# EAGLE design Drury-DABSC (EAGLE 7.7.0)
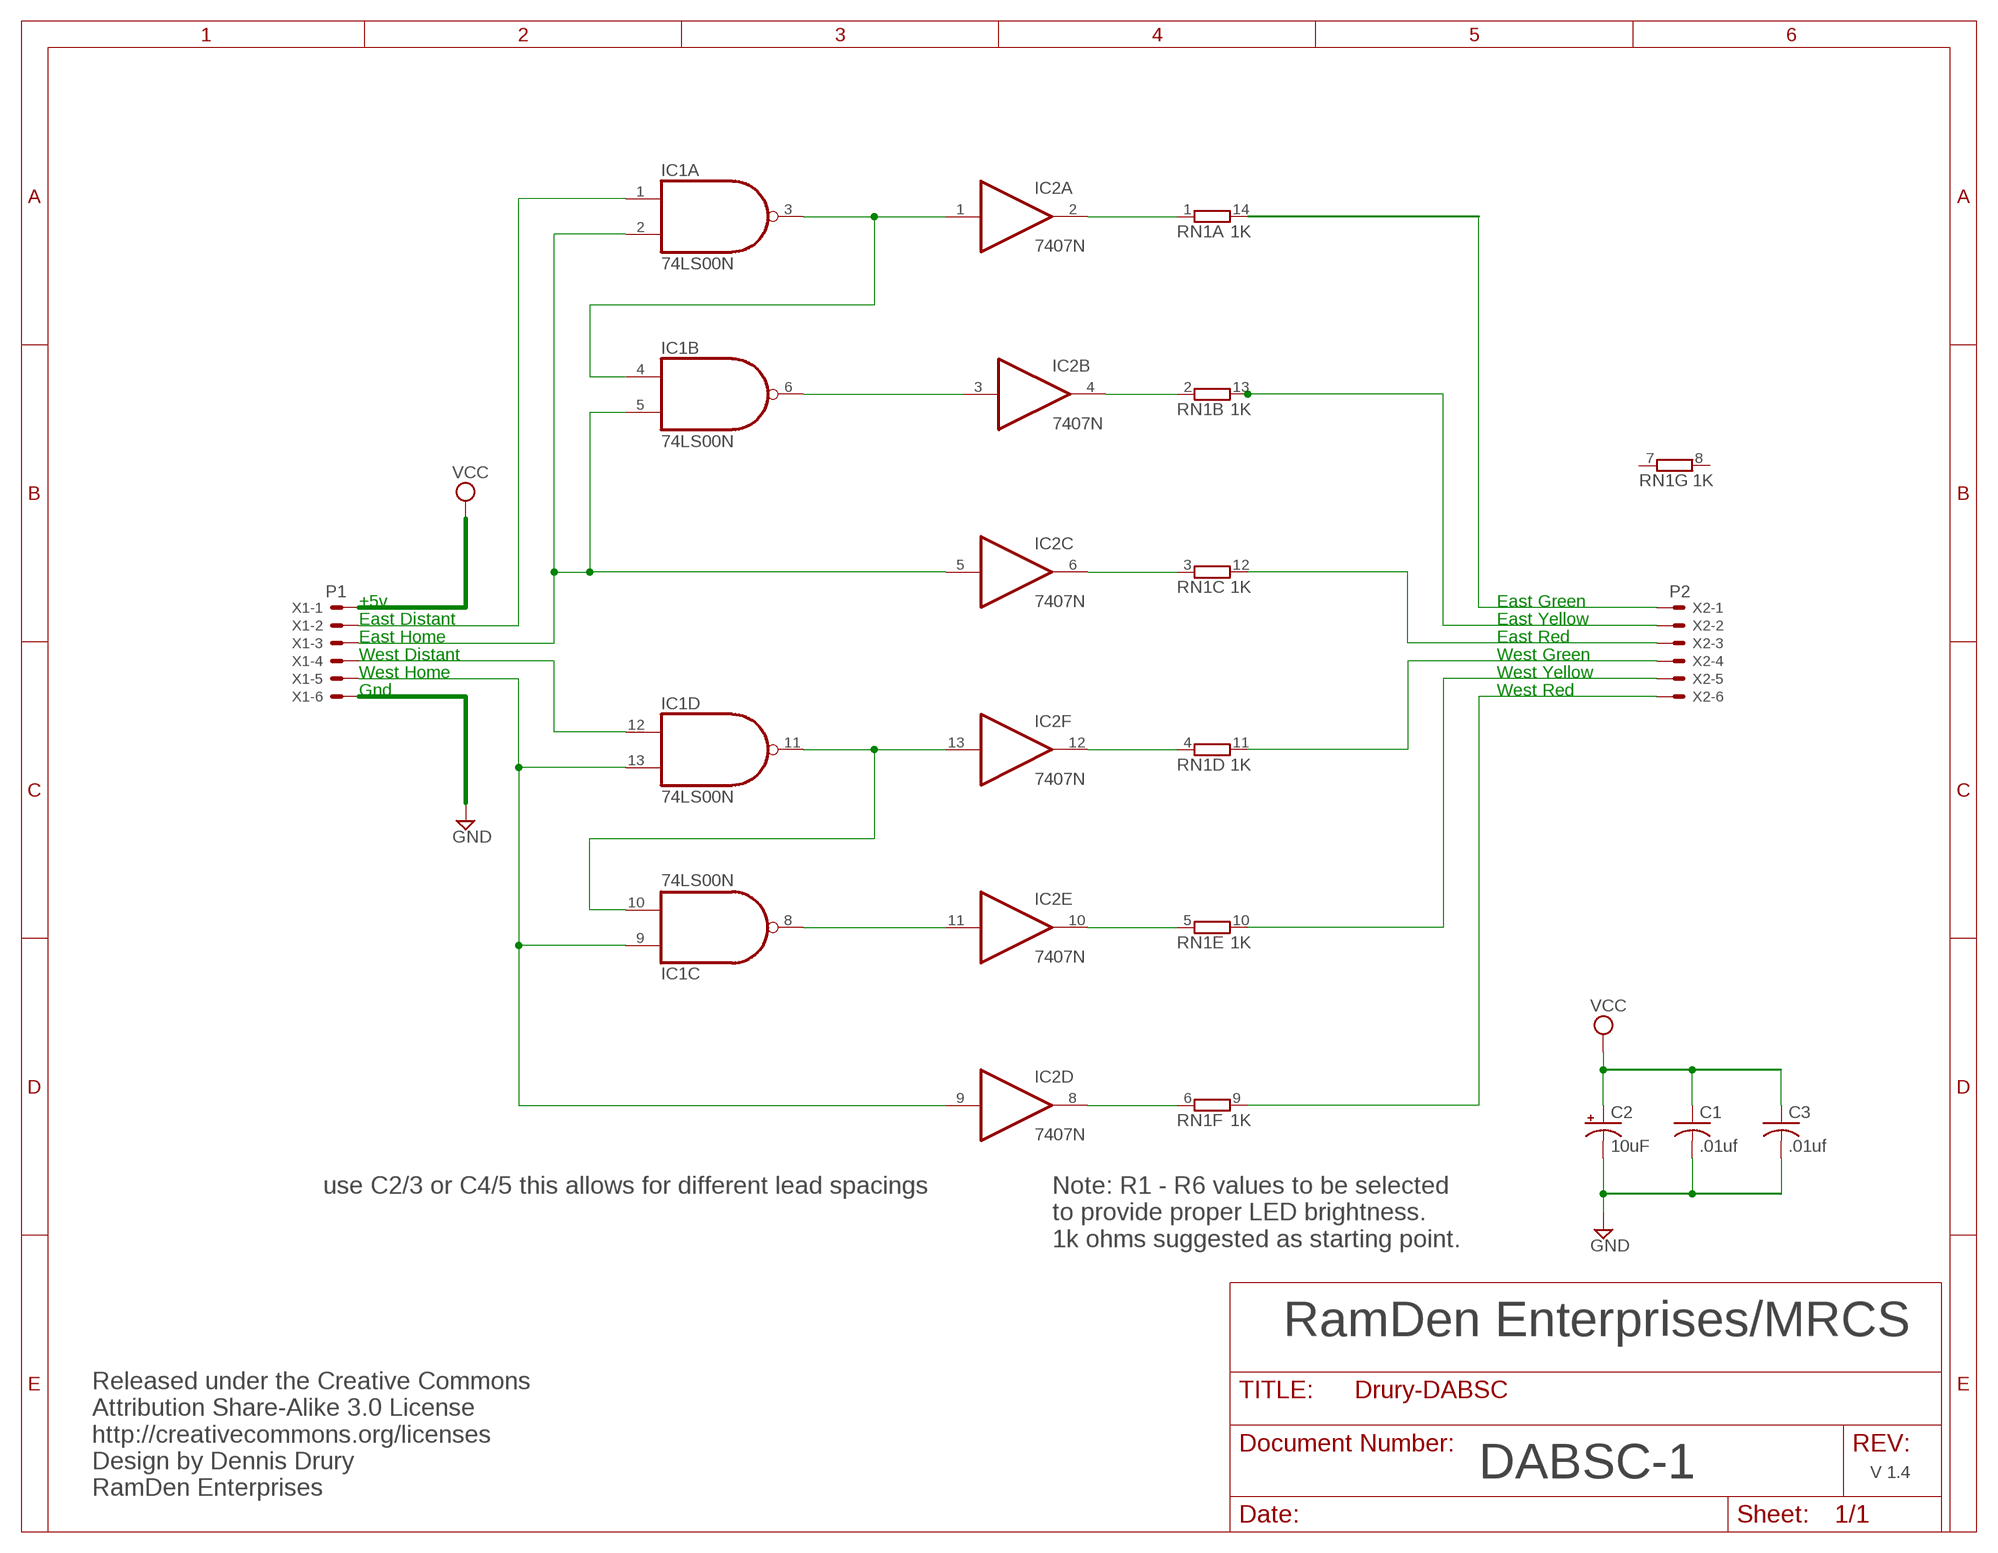
[diagram p0: schematic, sheet 1]

## Parts
C1  .01uf  C-US050-025X075  [C050-025X075]
C2  10uF  CAP-POLPTH-2MM  [E2-5]
C3  .01uf  C-US050-025X075  [C050-025X075]
IC1  74LS00N  [DIL14]
IC2  7407N  [DIL14]
RN1  1K  7R-N  [DIL14]
X1  P1  22-23-2061  [22-23-2061]
X2  P2  22-23-2061  [22-23-2061]

## Nets
GND [Power]: C1.2 C2.- C3.2 X1.6
N$1: IC1.3(A:O) IC1.4(B:I0) IC2.1(A:I)
N$2: IC1.6(B:O) IC2.3(B:I)
N$3: IC2.2(A:O) RN1.1
N$4 [Power]: IC1.8(C:O) IC2.11(E:I)
N$5: IC2.4(B:O) RN1.2
N$6: IC1.10(C:I1) IC1.11(D:O) IC2.13(F:I)
N$7: IC2.6(C:O) RN1.3
N$8: RN1.14 X2.1
N$9: RN1.13 X2.2
N$10: IC1.1(A:I0) X1.2
N$11: IC1.2(A:I1) IC1.5(B:I1) IC2.5(C:I) X1.3
N$12: RN1.12 X2.3
N$13: IC2.12(F:O) RN1.4
N$14: IC2.10(E:O) RN1.5
N$15: IC2.8(D:O) RN1.6
N$16: RN1.9 X2.6
N$17: RN1.10 X2.5
N$18: IC1.12(D:I0) X1.4
N$19: RN1.11 X2.4
N$21: IC1.9(C:I0) IC1.13(D:I1) IC2.9(D:I) X1.5
VCC [Power]: C1.1 C2.+ C3.1 X1.1
Unconnected: RN1.7 RN1.8

## Notes on the sheet
- +5v | East Green
- East Distant | East Yellow
- East Home | East Red
- West Distant | West Green
- West Home | West Yellow
- Gnd | West Red
- use C2/3 or C4/5 this allows for different lead spacings
- Note: R1 - R6 values to be selected
  to provide proper LED brightness.
  1k ohms suggested as starting point.
- RamDen Enterprises/MRCS
- DABSC-1 | V 1.4
- Released under the Creative Commons
  Attribution Share-Alike 3.0 License
  http://creativecommons.org/licenses
  Design by Dennis Drury
  RamDen Enterprises

## Power pins joined to a net without a drawn wire
GND: IC1.7(P:GND) IC2.7(P:GND)
VCC: IC1.14(P:VCC) IC2.14(P:VCC)

## Library data of the parts
C1 C3 = resistor:C-US: CAPACITOR, American symbol
C2 = SPCoast:CAP-POL*
IC1 = 74xx-us:74*00: Quad 2-input NAND gate
IC2 = 74xx-us:74*07: Hex BUFFER, open collector high-voltage output
RN1 = resistor-dil:7R-N: DIL RESISTOR; OC_FARNELL: unknown; OC_NEWARK: unknown
X1 X2 = con-molex:22-23-2061: .100" (2.54mm) Center Header - 6 Pin; MF: MOLEX; MPN: 22-23-2061; OC_FARNELL: 1462922; OC_NEWARK: 27C1933

## Net classes
0 Signal: width 0.051 mm, clearance 0.025 mm
1 Power: width 0.102 mm, clearance 0.025 mm to class 0

## Board
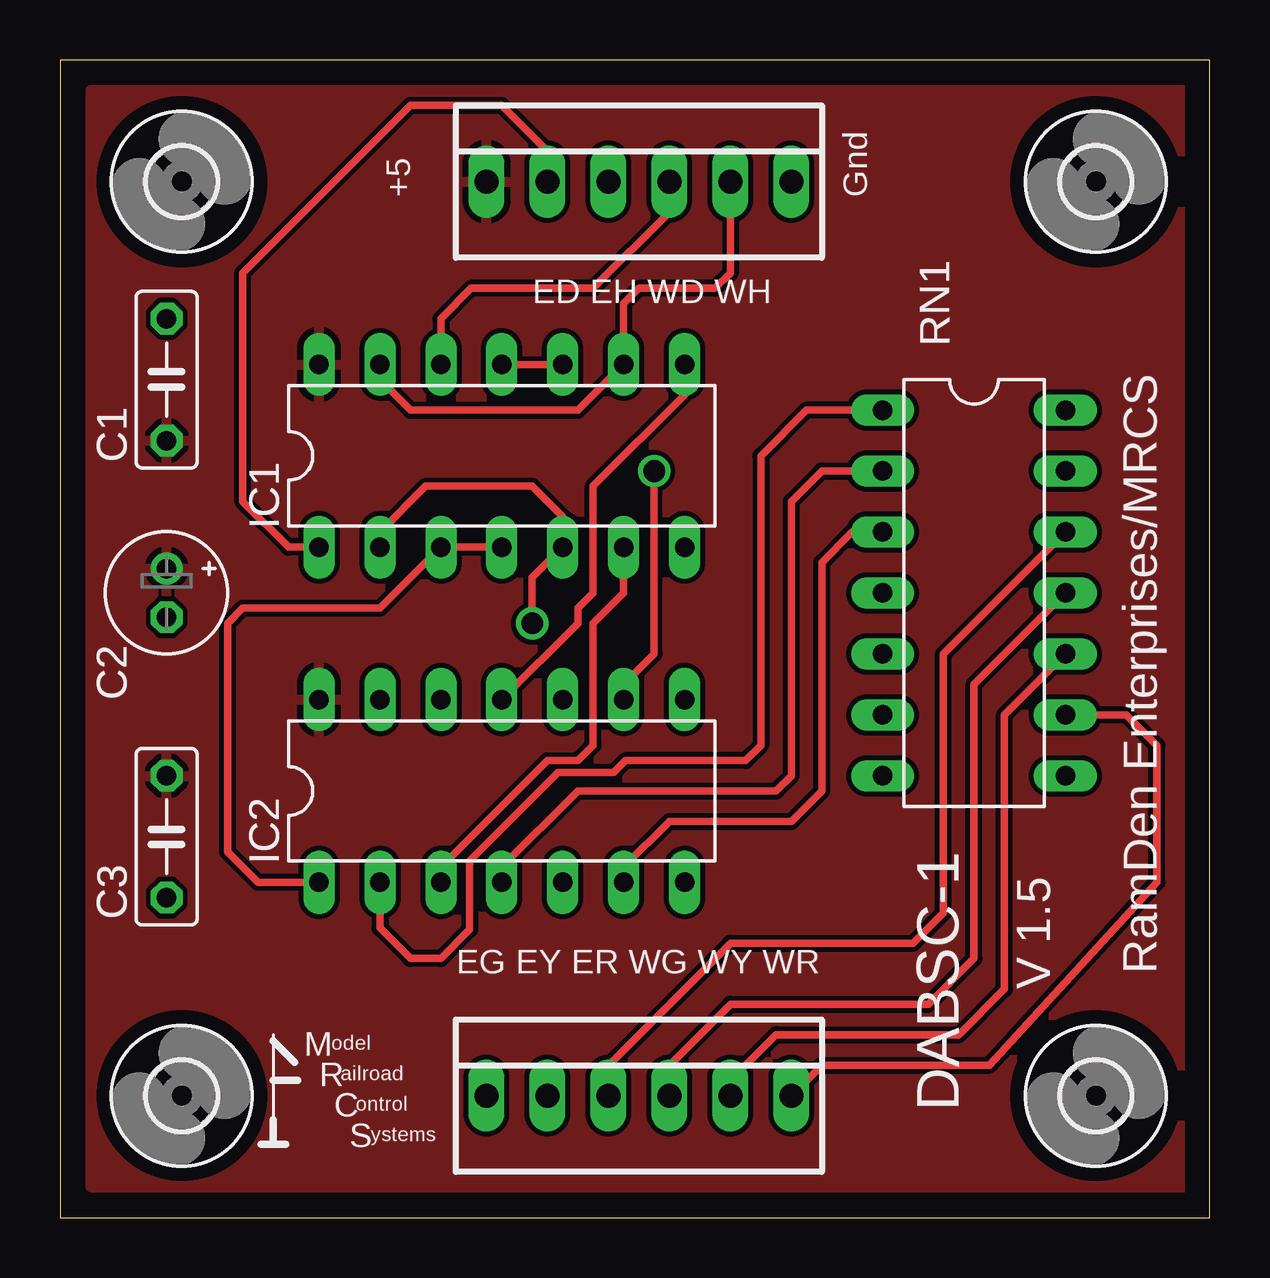
[diagram p1: board, top side]
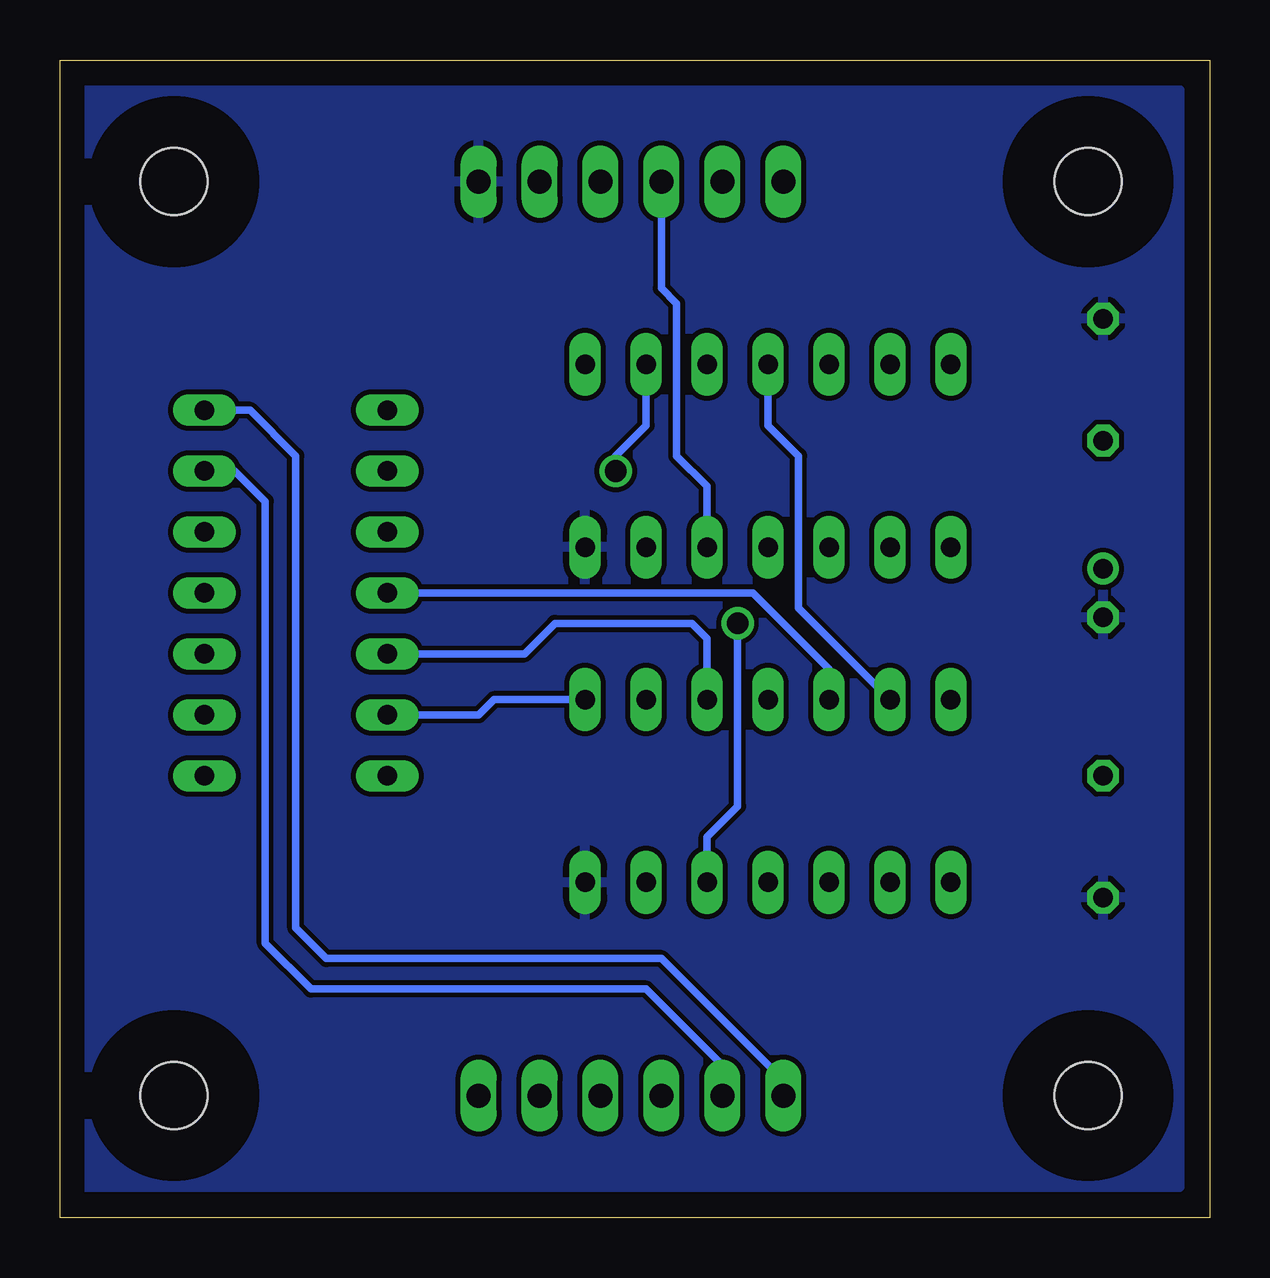
[diagram p2: board, bottom side, seen from below]

Size 47.93 x 48.25 mm. Coordinates in mm from the lower left corner, seen from the top.
Outline: 0,0 47.93,0 47.93,48.25 0,48.25 0,0
Copper layers (1*16): Top 0.035mm / dielectric 1.5mm / Bottom 0.035mm
Design rules "default": minimum track width 10mil, minimum drill 24mil, track to track 8mil, track to pad 8mil, pad to pad 8mil, via to via 8mil, smd to smd 8mil, copper to edge 40mil, drill to drill 8mil, minimum pad ring 10mil, minimum via ring 8mil, stop-mask expansion 4mil, vias tented up to drill 0mil, thermal gap 10mil

### Footprints (pad centres in the part's own frame; a part is rotated, then mirrored left to right if it is on the bottom)
C050-025X075 = drill 0.813 octagon: 1 -2.54,0; 2 2.54,0
E2-5 = drill 0.813 pad 1.27: + -1.016,0 | drill 0.813 pad 1.27 octagon: - 1.016,0
DIL14 = drill 0.813 long: 1 -7.62,-3.81; 2 -5.08,-3.81; 3 -2.54,-3.81; 4 0,-3.81; 5 2.54,-3.81; 6 5.08,-3.81; 7 7.62,-3.81; 8 7.62,3.81; 9 5.08,3.81; 10 2.54,3.81; 11 0,3.81; 12 -2.54,3.81; 13 -5.08,3.81; 14 -7.62,3.81
2,8 = hole 2.8: 0,0
22-23-2061 = drill 1 long: 1 -6.35,0; 2 -3.81,0; 3 -1.27,0; 4 1.27,0; 5 3.81,0; 6 6.35,0

### Placement (x,y rotation side)
C1  4.45,34.92 90 top
C2  4.45,26.04 270 top
C3  4.45,15.88 270 top
IC1  18.41,31.75 0 top
IC2  18.41,17.78 0 top
RN1  38.1,26.04 270 top
U$1  [2,8]  5.08,43.18 0 top
U$2  [2,8]  43.18,43.18 0 top
U$3  [2,8]  5.08,5.08 0 top
U$4  [2,8]  43.18,5.08 0 top
U$5  [MRCSLOGOTOP]  7.62,2.54 0 top
U$6  [CA-PROP65-BACK]  34.92,6.99 0 top
X1  24.13,43.18 0 top
X2  24.13,5.08 0 top

### Tracks (layer width: path | path; a pad name or v marks a point on that pad's centre or on a via)
GND
  pour Bottom: 1.27,1.27 46.99,1.27 46.99,46.99 1.27,46.99
N$1
  Top 0.305: IC2.1 8.26,13.97 6.99,15.24 6.99,24.77 7.62,25.4 13.34,25.4 IC1.3 IC1.4
N$2
  Top 0.305: IC2.3 15.88,14.61 20.32,19.05 21.59,19.05 22.23,19.68 22.23,24.77 23.5,26.04 IC1.6
N$3
  Top 0.305: RN1.1 31.11,33.66 29.21,31.75 29.21,19.68 28.57,19.05 23.58,19.05 23.07,18.54 20.76,18.54 17.08,14.86 17.08,12 15.88,10.79 14.61,10.79 13.34,12.06 IC2.2
N$4
  Top 0.305: IC1.8 26.04,34.29 22.23,30.48 22.23,26.04 21.59,25.4 21.59,24.77 IC2.11
N$5
  Top 0.305: IC2.4 18.41,14.61 21.59,17.78 29.84,17.78 30.48,18.41 30.48,29.84 31.75,31.11 RN1.2
N$6
  Top 0.305: IC1.11 IC1.10
  Bottom 0.305: IC2.13 17.14,25.4 17.14,31.75 18.41,33.02 IC1.11
N$7
  Top 0.305: IC2.6 23.5,14.61 25.4,16.51 30.48,16.51 31.75,17.78 31.75,27.3 33.02,28.57 RN1.3
N$8
  Bottom 0.305: X2.1 17.78,5.71 22.86,10.79 36.83,10.79 38.1,12.06 38.1,31.75 40.01,33.66 RN1.14
N$9
  Bottom 0.305: X2.2 20.32,6.35 23.5,9.53 37.47,9.53 39.37,11.43 39.37,29.84 40.64,31.11 RN1.13
N$10
  Top 0.305: IC1.1 9.53,27.94 7.62,29.84 7.62,39.37 14.61,46.35 18.41,46.35 20.32,44.45 X1.2
N$11  (via drill 0.9)
  Top 0.305: IC1.2 13.34,28.57 15.24,30.48 19.68,30.48 20.95,29.21 IC1.5 19.68,26.67 v19.68,24.77
  Bottom 0.305: X1.3 22.86,38.73 22.23,38.1 22.23,31.75 20.95,30.48 IC1.5 | IC2.5 20.95,15.88 19.68,17.14 v19.68,24.77
N$12
  Top 0.305: X2.3 22.86,6.35 27.94,11.43 35.56,11.43 36.83,12.7 36.83,23.5 RN1.12
N$13
  Bottom 0.305: IC2.12 15.88,22.86 19.05,26.04 RN1.4
N$14
  Bottom 0.305: RN1.5 28.57,23.5 27.3,24.77 21.59,24.77 20.95,24.13 IC2.10
N$15
  Bottom 0.305: IC2.8 29.84,21.59 30.48,20.95 RN1.6
N$16
  Top 0.305: RN1.9 44.45,20.95 45.72,19.68 45.72,13.97 38.73,6.35 31.75,6.35 X2.6
N$17
  Top 0.305: X2.5 27.94,5.71 29.84,7.62 37.47,7.62 39.37,9.53 39.37,20.95 RN1.10
N$18
  Top 0.305: X1.4 25.4,41.91 22.23,38.73 17.14,38.73 15.88,37.47 IC1.12
N$19
  Top 0.305: X2.4 25.4,6.35 27.94,8.89 36.2,8.89 38.1,10.79 38.1,22.23 RN1.11
N$21  (via drill 0.9)
  Top 0.305: X1.5 27.94,39.37 27.3,38.73 24.13,38.73 23.5,38.1 IC1.9 21.59,33.66 14.61,33.66 13.34,34.92 IC1.13 | IC2.9 23.5,22.23 24.77,23.5 v24.77,31.11
  Bottom 0.305: v24.77,31.11 24.77,31.75 23.5,33.02 IC1.9
VCC
  pour Top: 1.27,1.27 46.99,1.27 46.99,46.99 1.27,46.99

### Text on the board
tPlace: ED EH WD WH | EG EY ER WG WY WR | RamDen Enterprises/MRCS
tNames: +5 | Gnd | V 1.5 | DABSC-1
_tNames: RN1 | C1 | IC1 | C2 | IC2 | C3